# EAGLE design PiHat (EAGLE 9.3.2)

## Sheet 1 of 3
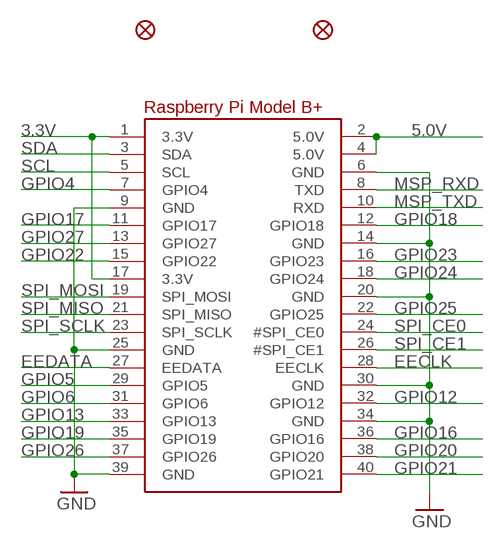
[diagram p0: schematic, sheet 1]

### Parts
FID2  FIDUCIAL""  [FIDUCIAL_1MM]
FID3  FIDUCIAL""  [FIDUCIAL_1MM]
RPI1  RASPBERRYPI_BPLUS_HATNOSLOTS  [PI_HAT_NOSLOTS]

### Nets
3.3V: RPI1.1(3.3V) RPI1.17(3.3V)
5.0V: RPI1.2(5.0V) RPI1.4(5.0V) ; also sheet 2,3
EECLK: RPI1.28(EECLK)
EEDATA: RPI1.27(EEDATA)
GND: RPI1.6(GND) RPI1.9(GND) RPI1.14(GND) RPI1.20(GND) RPI1.25(GND) RPI1.30(GND) RPI1.34(GND) RPI1.39(GND) ; also sheet 2,3
GPIO4: RPI1.7(GPIO4)
GPIO5: RPI1.29(GPIO5) ; also sheet 2
GPIO6: RPI1.31(GPIO6) ; also sheet 2
GPIO12: RPI1.32(GPIO12)
GPIO13: RPI1.33(GPIO13)
GPIO16: RPI1.36(GPIO16) ; also sheet 2
GPIO17: RPI1.11(GPIO17) ; also sheet 2
GPIO18: RPI1.12(GPIO18) ; also sheet 2
GPIO19: RPI1.35(GPIO19) ; also sheet 2
GPIO20: RPI1.38(GPIO20)
GPIO21: RPI1.40(GPIO21)
GPIO22: RPI1.15(GPIO22)
GPIO23: RPI1.16(GPIO23)
GPIO24: RPI1.18(GPIO24) ; also sheet 2
GPIO25: RPI1.22(GPIO25) ; also sheet 2
GPIO26: RPI1.37(GPIO26) ; also sheet 2
GPIO27: RPI1.13(GPIO27) ; also sheet 2
MSP_RXD: RPI1.8(TXD) ; also sheet 2,3
MSP_TXD: RPI1.10(RXD) ; also sheet 2,3
SCL: RPI1.5(SCL)
SDA: RPI1.3(SDA)
SPI_CE0: RPI1.24(#SPI_CE0)
SPI_CE1: RPI1.26(#SPI_CE1)
SPI_MISO: RPI1.21(SPI_MISO)
SPI_MOSI: RPI1.19(SPI_MOSI)
SPI_SCLK: RPI1.23(SPI_SCLK)

## Sheet 2 of 3
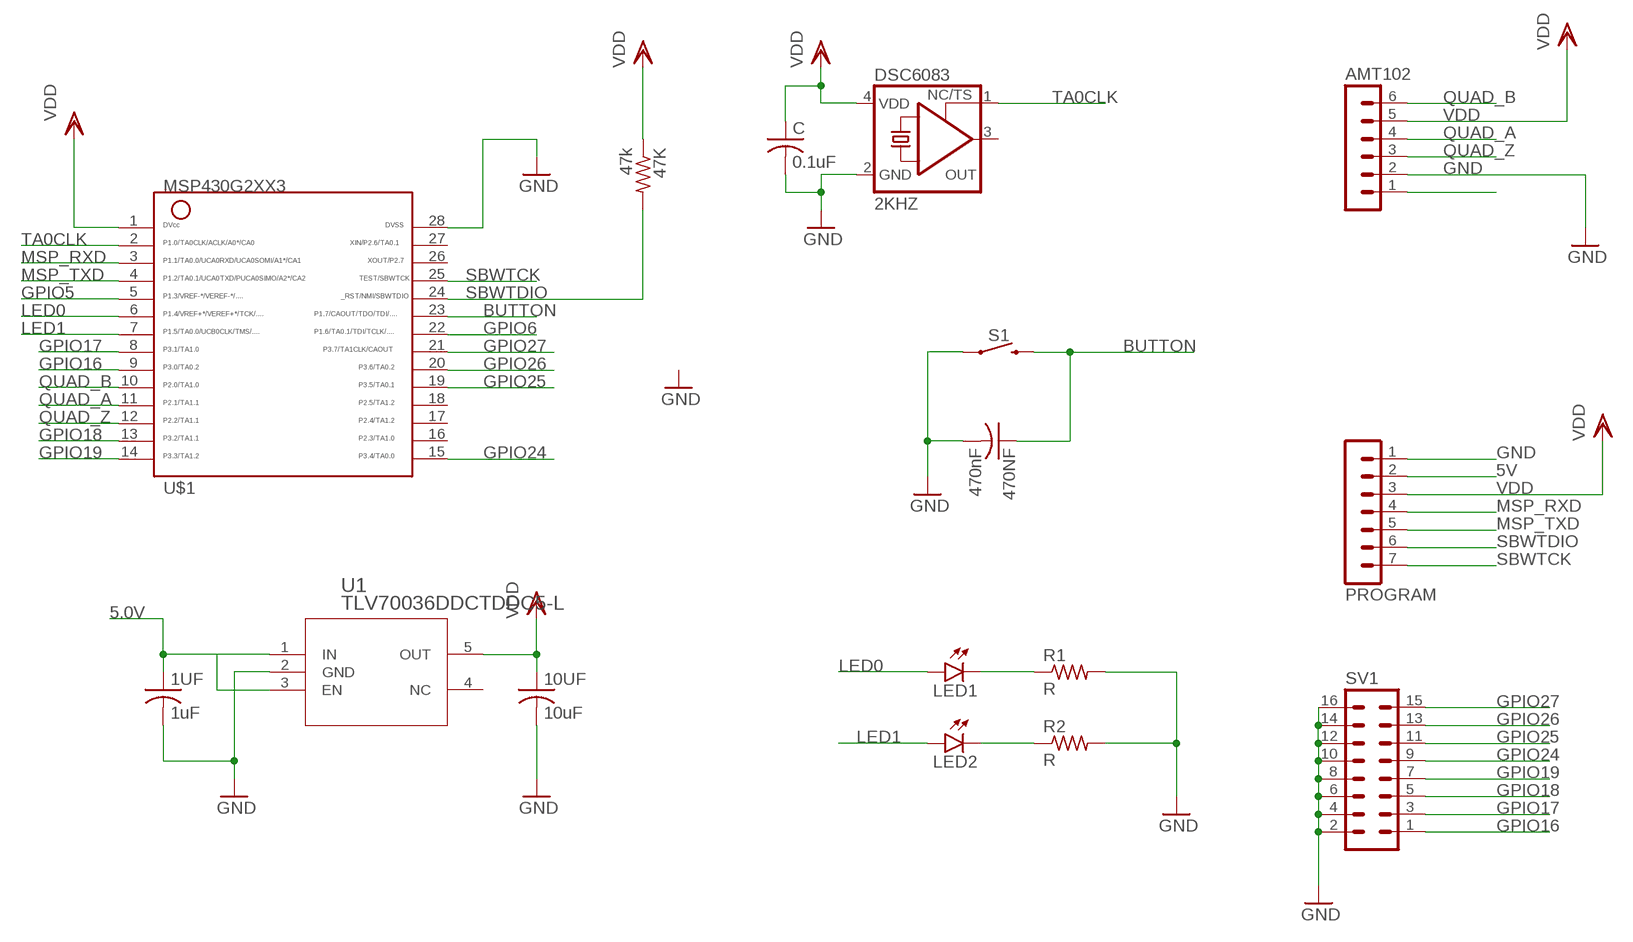
[diagram p1: schematic, sheet 2]

### Parts
1UF  1uF  C-USC0603  [C0603]
10UF  10uF  C-USC1206  [C1206]
47K  47k  R-US_R0603  [R0603]
470NF  470nF  C-USC0603  [C0603]
AMT102  MA06-1  [MA06-1]
C  0.1uF  C-USC0603  [C0603]
DSC6083  2KHZ  KXO-PXO/XO-V96  [3.2X2.5_KXO-V96]
LED1  LEDCHIPLED_1206  [CHIPLED_1206]
LED2  LEDCHIPLED_1206  [CHIPLED_1206]
PROGRAM  MA07-1  [MA07-1]
R1  R  R-US_R0603  [R0603]
R2  R  R-US_R0603  [R0603]
S1  MOMENTARY-SWITCH-SPST-PTH-6.0MM  [TACTILE_SWITCH_PTH_6.0MM]
SV1  MA08-2  [MA08-2]
U1  TLV70036DDCTDDC5-L  [DDC5-L]
U$1  MSP430  G2XX3---PW28  [PW28]

### Nets
5.0V: 1UF.1 U1.1(IN) U1.3(EN) ; also sheet 1,3
5V: PROGRAM.2
BUTTON: 470NF.1 S1.3 U$1.23
GND: 1UF.2 10UF.2 470NF.2 AMT102.2 C.2 DSC6083.2(GND) PROGRAM.1 R1.2 R2.2 S1.1 SV1.2 SV1.4 SV1.6 SV1.8 SV1.10 SV1.12 SV1.14 SV1.16 U1.2(GND) U$1.28 ; also sheet 1,3
GPIO5: U$1.5 ; also sheet 1
GPIO6: U$1.22 ; also sheet 1
GPIO16: SV1.1 U$1.9 ; also sheet 1
GPIO17: SV1.3 U$1.8 ; also sheet 1
GPIO18: SV1.5 U$1.13 ; also sheet 1
GPIO19: SV1.7 U$1.14 ; also sheet 1
GPIO24: SV1.9 U$1.15 ; also sheet 1
GPIO25: SV1.11 U$1.19 ; also sheet 1
GPIO26: SV1.13 U$1.20 ; also sheet 1
GPIO27: SV1.15 U$1.21 ; also sheet 1
LED0: LED1.A U$1.6
LED1: LED2.A U$1.7
MSP_RXD: PROGRAM.4 U$1.3 ; also sheet 1,3
MSP_TXD: PROGRAM.5 U$1.4 ; also sheet 1,3
N$1: LED1.C R1.1
N$2: LED2.C R2.1
N$6: AMT102.1
QUAD_A: AMT102.4 U$1.11
QUAD_B: AMT102.6 U$1.10
QUAD_Z: AMT102.3 U$1.12
SBWTCK: PROGRAM.7 U$1.25
SBWTDIO: 47K.2 PROGRAM.6 U$1.24
TA0CLK: DSC6083.1(TS) U$1.2
VDD: 10UF.1 47K.1 AMT102.5 C.1 DSC6083.4(VDD) PROGRAM.3 U1.5(OUT) U$1.1
Unconnected: DSC6083.3(OUT) U1.4(NC) U$1.16 U$1.17 U$1.18 U$1.26 U$1.27

## Sheet 3 of 3
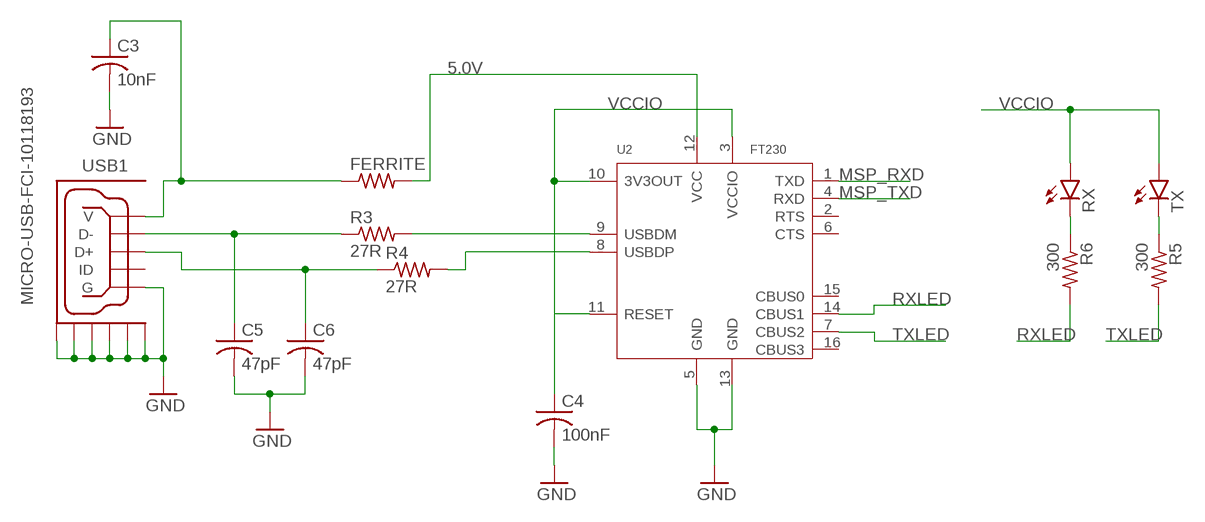
[diagram p2: schematic, sheet 3]

### Parts
C3  10nF  C-USC0603  [C0603]
C4  100nF  C-USC0603  [C0603]
C5  47pF  C-USC0603  [C0603]
C6  47pF  C-USC0603  [C0603]
FERRITE  R-US_R0805  [R0805]
R3  27R  R-US_R0603  [R0603]
R4  27R  R-US_R0603  [R0603]
R5  300  R-US_R0603  [R0603]
R6  300  R-US_R0603  [R0603]
RX  LEDCHIPLED_1206  [CHIPLED_1206]
TX  LEDCHIPLED_1206  [CHIPLED_1206]
U2  FT230  INTERFACE-FT230XS-R(SSOP16)  [SSOP16-0.635-5X4MM]
USB1  MICRO-USB-FCI-10118193  [FCI-10118193-0001LF]

### Nets
5.0V: FERRITE.2 U2.12(VCC) ; also sheet 1,2
GND: C3.2 C4.2 C5.2 C6.2 U2.5(GND) U2.13(GND) USB1.5(G) USB1.G1(GND1) USB1.G2(GND2) USB1.G3(GND3) USB1.G4(GND4) USB1.G5(GND5) USB1.G6(GND6) ; also sheet 1,2
MSP_RXD: U2.1(TXD) ; also sheet 1,2
MSP_TXD: U2.4(RXD) ; also sheet 1,2
N$3: C3.1 FERRITE.1 USB1.1(V)
N$4: C5.1 R3.1 USB1.2(D-)
N$5: R3.2 U2.9(USBDM)
N$7: C6.1 R4.1 USB1.3(D+)
N$8: R4.2 U2.8(USBDP)
N$9: R6.1 RX.C
N$10: R5.1 TX.C
RXLED: R6.2 U2.14(CBUS1)
TXLED: R5.2 U2.7(CBUS2)
VCCIO: C4.1 RX.A TX.A U2.3(VCCIO) U2.10(3V3OUT) U2.11(RESET)
Unconnected: U2.2(RTS) U2.6(CTS) U2.15(CBUS0) U2.16(CBUS3) USB1.4(ID)

## Library data of the parts
1UF 10UF 470NF C = rcl:C-US: CAPACITOR, American symbol; SPICEPREFIX: C
47K FERRITE R1 R2 = rcl:R-US_: RESISTOR, American symbol; SPICEPREFIX: R
AMT102 = con-lstb-mod:MA06-1: PIN HEADER; OC_FARNELL: unknown; OC_NEWARK: unknown
C3-C6 = resistor:C-US: CAPACITOR, American symbol
DSC6083 = crystal-geyer_V1_0:KXO-PXO/XO-V: Clock Oscillator (PXO/XO) MHz : KXO-V - Serie Model Size l/w/h [mm] Frequency Range Frequency Stability Temp. Range [°C] Output AECQ 200 availabel Datasheet KXO-V94 KXO-V94 KXO-V95 KXO-V95 KXO-V96 KXO-V96 KXO-V99 KXO-V99 KXO-97 KXO-V97 KXO-97 - KXO-V97 2.0/1.6/0.80 2.0/1.6/0.80 2.5/2.0/0.82 2.5/2.0/0.82 3.2/2.5/1.2 3.2/2.5/1.2 5.0/3.2/1.2 5.0/3.2/1.2 7.0/5.08/1.3 7.0/5.08/1.3 7.0/5.08/1.3 32,768 kHz 1,0 ~ 80,0 MHz 32,768 kHz 1,0 ~ 70,0 MHz 32,768 kHz 1,0 ~ 156,0 MHz 32,768 kHz 1,0 ~ 200,0 MHz 32,768 kHz 32,768 kHz 1,0 ~ 160,0 MHz ±25 … ±100ppm ±25 … ±100ppm ±25 … ±100ppm ±25 … ±100ppm ±25 … ±100ppm ±25 … ±100ppm ±25 … ±100ppm ±25 … ±100ppm ±25 … ±100ppm ±25 … ±100ppm ±25 … ±100ppm (*) -40°C …+85°C (*) -40°C …+85°C (*) -40°C …+85°C (*) -40°C …+85°C (*) -40°C …+85°C (*) -40°C …+85°C (*) -40°C …+85°C (*) -40°C …+85°C (*) -40°C …+85°C (*) -40°C …+85°C (*) -40°C …+85°C HCMOS HCMOS HCMOS HCMOS HCMOS HCMOS HCMOS HCMOS HCMOS HCMOS HCMOS - - yes yes yes yes - - - - - KXO-V94-kHz.pdf <http://www.geyer-electronic.de/uploads/tx_userartikelfrequenz/GEYER-KXO-V94-kHz.pdf> KXO-V94.pdf <http://www.geyer-electronic.de/uploads/tx_userartikelfrequenz/GEYER-KXO-V94.pdf> KXO-V95-kHz.pdf <http://www.geyer-electronic.de/uploads/tx_userartikelfrequenz/GEYER-KXO-V95-kHz.pdf> KXO-V95.pdf <http://www.geyer-electronic.de/uploads/tx_userartikelfrequenz/GEYER-KXO-V95.pdf> KXO-V96-kHz.pdf <http://www.geyer-electronic.de/uploads/tx_userartikelfrequenz/GEYER-KXO-V96-kHz.pdf> KXO-V96.pdf <http://www.geyer-electronic.de/uploads/tx_userartikelfrequenz/GEYER-KXO-V96.pdf> KXO-V99-kHz.pdf <http://www.geyer-electronic.de/uploads/tx_userartikelfrequenz/GEYER-KXO-V99-kHz.pdf> KXO-V99.pdf <http://www.geyer-electronic.de/uploads/tx_userartikelfrequenz/GEYER-KXO-V99.pdf> KXO-97-kHz.pdf <http://www.geyer-electronic.de/uploads/tx_userartikelfrequenz/GEYER-KXO-97-kHz.pdf> KXO-V97-kHz.pdf <http://www.geyer-electronic.de/uploads/tx_userartikelfrequenz/GEYER-KXO-V97-kHz.pdf> KXO-V97.pdf <http://www.geyer-electronic.de/uploads/tx_userartikelfrequenz/GEYER-KXO-V97.pdf> <http://www.geyer-electronic.de/fileadmin/template/img/logo-geyer-electronic.png> Details see: http://www.geyer-electronic.de/Frequenz-Produkte.9.0.html Created 2016-06-07, Hans Locher 2016 (C) Geyer Quartz Technology Hans Locher KXOV94,KXOV95;KXOV96;KXOV97;KXO97;2016;2520;3225;5032;70508;2,5x2,0;3,2x2,5;5,0x3,2;7,0x5,08;2.5x2.0;3.2x2.5;5.0x3.2;7.0x5.08;
FID2 FID3 = microbuilder:FIDUCIAL: Fiducial Alignment Points Various fiducial points for machine vision alignment.; BOM: EXCLUDE
LED1 LED2 RX TX = led:LED: LED OSRAM: - CHIPLED LG R971, LG N971, LY N971, LG Q971, LY Q971, LO R971, LY R971 LH N974, LH R974 LS Q976, LO Q976, LY Q976 LO Q996 - Hyper CHIPLED LW Q18S LB Q993, LB Q99A, LB R99A - SideLED LS A670, LO A670, LY A670, LG A670, LP A670 LB A673, LV A673, LT A673, LW A673 LH A674 LY A675 LS A676, LA A676, LO A676, LY A676, LW A676 LS A679, LY A679, LG A679 - Hyper Micro SIDELED® LS Y876, LA Y876, LO Y876, LY Y876 LT Y87S - SmartLED LW L88C, LW L88S LB L89C, LB L89S, LG L890 LS L89K, LO L89K, LY L89K LS L896, LA L896, LO L896, LY L896 - TOPLED LS T670, LO T670, LY T670, LG T670, LP T670 LSG T670, LSP T670, LSY T670, LOP T670, LYG T670 LG T671, LOG T671, LSG T671 LB T673, LV T673, LT T673, LW T673 LH T674 LS T676, LA T676, LO T676, LY T676, LB T676, LH T676, LSB T676, LW T676 LB T67C, LV T67C, LT T67C, LS T67K, LO T67K, LY T67K, LW E67C LS E67B, LA E67B, LO E67B, LY E67B, LB E67C, LV E67C, LT E67C LW T67C LS T679, LY T679, LG T679 LS T770, LO T770, LY T770, LG T770, LP T770 LB T773, LV T773, LT T773, LW T773 LH T774 LS E675, LA E675, LY E675, LS T675 LS T776, LA T776, LO T776, LY T776, LB T776 LHGB T686 LT T68C, LB T68C - Hyper Mini TOPLED® LB M676 - Mini TOPLED Santana® LG M470 LS M47K, LO M47K, LY M47K Source: http://www.osram.convergy.de LUXEON: - LUMILED® LXK2-PW12-R00, LXK2-PW12-S00, LXK2-PW14-U00, LXK2-PW14-V00 LXK2-PM12-R00, LXK2-PM12-S00, LXK2-PM14-U00 LXK2-PE12-Q00, LXK2-PE12-R00, LXK2-PE12-S00, LXK2-PE14-T00, LXK2-PE14-U00 LXK2-PB12-K00, LXK2-PB12-L00, LXK2-PB12-M00, LXK2-PB14-N00, LXK2-PB14-P00, LXK2-PB14-Q00 LXK2-PR12-L00, LXK2-PR12-M00, LXK2-PR14-Q00, LXK2-PR14-R00 LXK2-PD12-Q00, LXK2-PD12-R00, LXK2-PD12-S00 LXK2-PH12-R00, LXK2-PH12-S00 LXK2-PL12-P00, LXK2-PL12-Q00, LXK2-PL12-R00 Source: www.luxeon.com KINGBRIGHT: KA-3528ASYC Source: www.kingbright.com
PROGRAM = con-lstb-mod:MA07-1: PIN HEADER; OC_FARNELL: unknown; OC_NEWARK: unknown
R3-R6 = resistor:R-US_: RESISTOR, American symbol
RPI1 = microbuilder:RASPBERRYPI_BPLUS
S1 = SparkFun-Switches:MOMENTARY-SWITCH-SPST: Momentary Switch (Pushbutton) - SPST Normally-open (NO) SPST momentary switches (buttons, pushbuttons). Variants PTH-12MM - 12mm square, through-hole Momentary Pushbutton Switch - 12mm Square <https://www.sparkfun.com/products/9190> (COM-09190) PTH-6.0MM, PTH-6.0MM-KIT - 6.0mm square, through-hole Mini Pushbutton Switch <https://www.sparkfun.com/products/97> (COM-00097) KIT package intended for soldering kit's - only one side of pads' copper is exposed. PTH-RIGHT-ANGLE-KIT - Right-angle, through-hole Right Angle Tactile Button <https://www.sparkfun.com/products/10791> - Used on SparkFun BigTime Watch Kit <https://www.sparkfun.com/products/11734> SMD-12MM - 12mm square, surface-mount Tactile Button - SMD (12mm) <https://www.sparkfun.com/products/12993> (COM-12993) Used on SparkFun PicoBoard <https://www.sparkfun.com/products/11888> SMD-4.5MM - 4.5mm Square Trackball Switch Used on SparkFun Blackberry Trackballer Breakout <https://www.sparkfun.com/products/13169> SMD-4.6MMX2.8MM - 4.60mm x 2.80mm, surface mount Used on SparkFun SAMD21 Mini Breakout <https://www.sparkfun.com/products/13664> SMD-5.2MM, SMD-5.2-REDUNDANT - 5.2mm square, surface-mount Mini Pushbutton Switch - SMD <https://www.sparkfun.com/products/8720> (COM-08720) Used on Arduino Pro Mini <https://www.sparkfun.com/products/11114> REDUNDANT package connects both switch circuits together SMD-6.0X3.5MM - 6.0 x 3.5mm, surface mount Momentary Reset Switch SMD <https://www.sparkfun.com/products/8229> (COM-08229) SMD-6.2MM-TALL - 6.2mm square, surface mount Tactile Button - SMD (6mm) <https://www.sparkfun.com/products/12992> Used on SparkFun Digital Sandbox <https://www.sparkfun.com/products/12651> SMD-RIGHT-ANGLE - Right-angle, surface mount Used on SparkFun Block for Intel® Edison - Arduino <https://www.sparkfun.com/products/13036>; PROD_ID: SWCH-08441; SF_SKU: COM-00097
SV1 = con-lstb-mod:MA08-2: PIN HEADER; OC_FARNELL: unknown; OC_NEWARK: unknown
U1 = TLV70036:TLV70036DDCT; MANUFACTURER_PART_NUMBER: TLV70036DDCT; VENDOR: Texas Instruments
U2 = OPL_IC:INTERFACE-FT230XS-R(SSOP16): 310070030; MPN: FT230XS-R; VALUE: FT230XS-R-SSOP16
U$1 = TI_MSP430_v16:G2XX3---PW28: MSP430G2XX1 TSSOP (PW) 28 Pin Package
USB1 = microftx:MICRO-USB: MICRO USB B, BOTTOM MOUNT From the MicroFTX by Jim Paris (http://jim.sh/ftx)

## Board
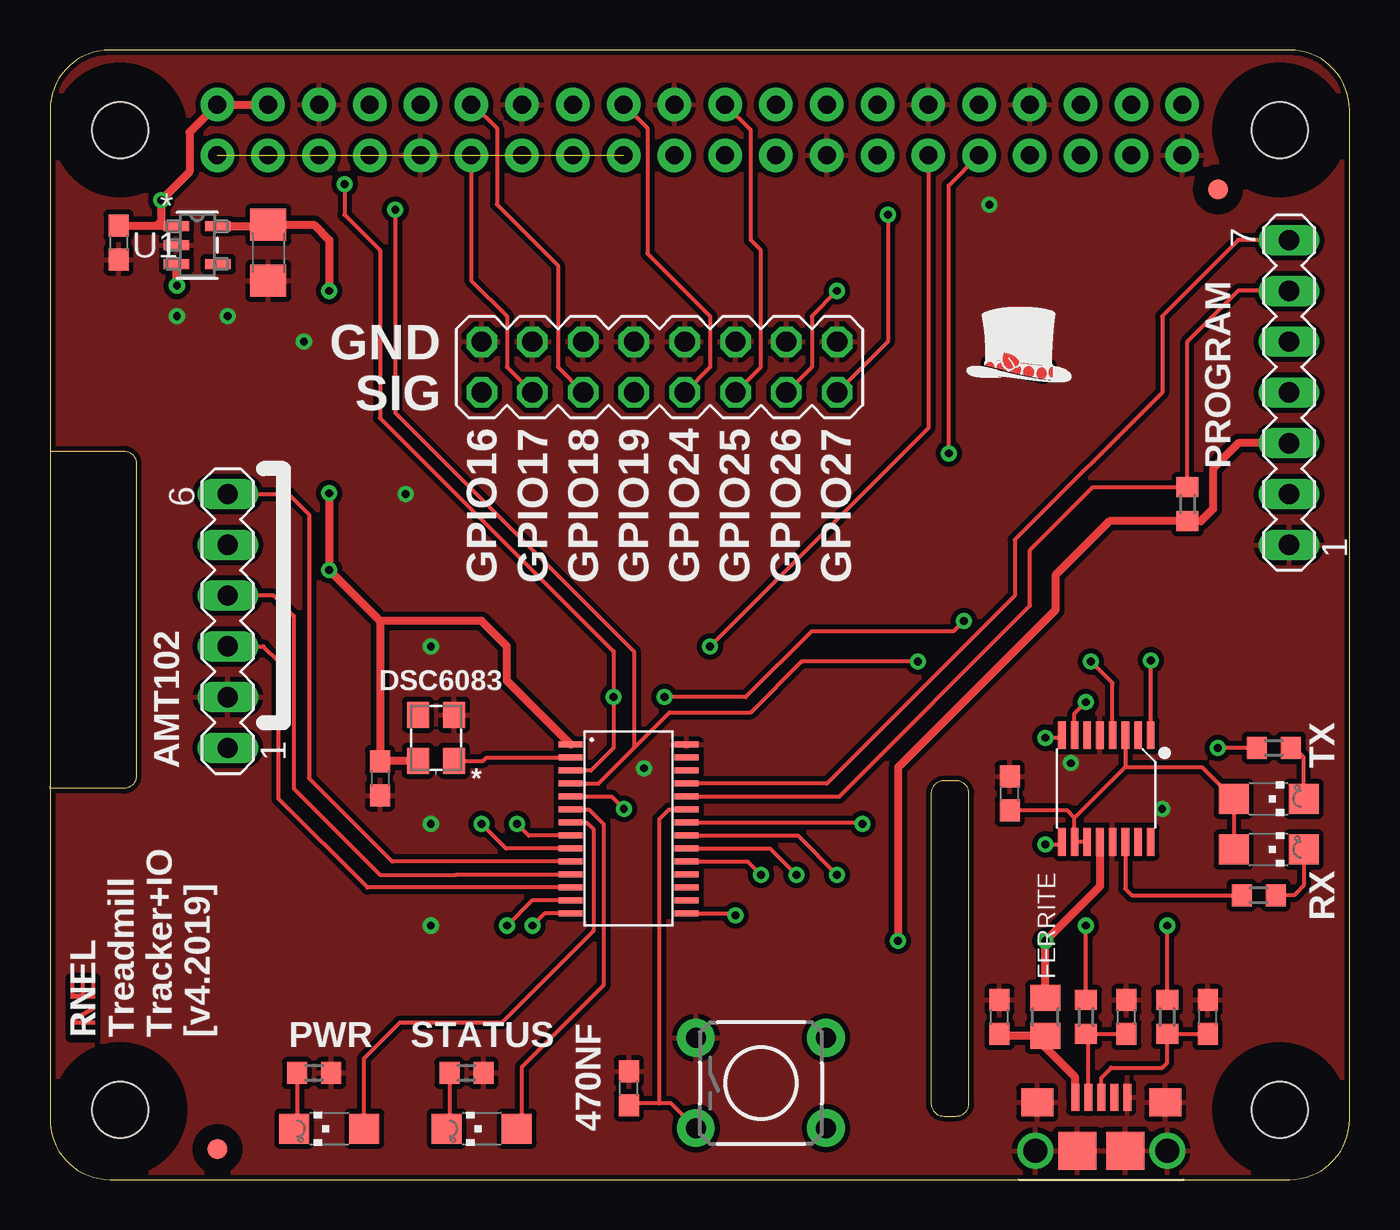
[diagram p3: board, top side]
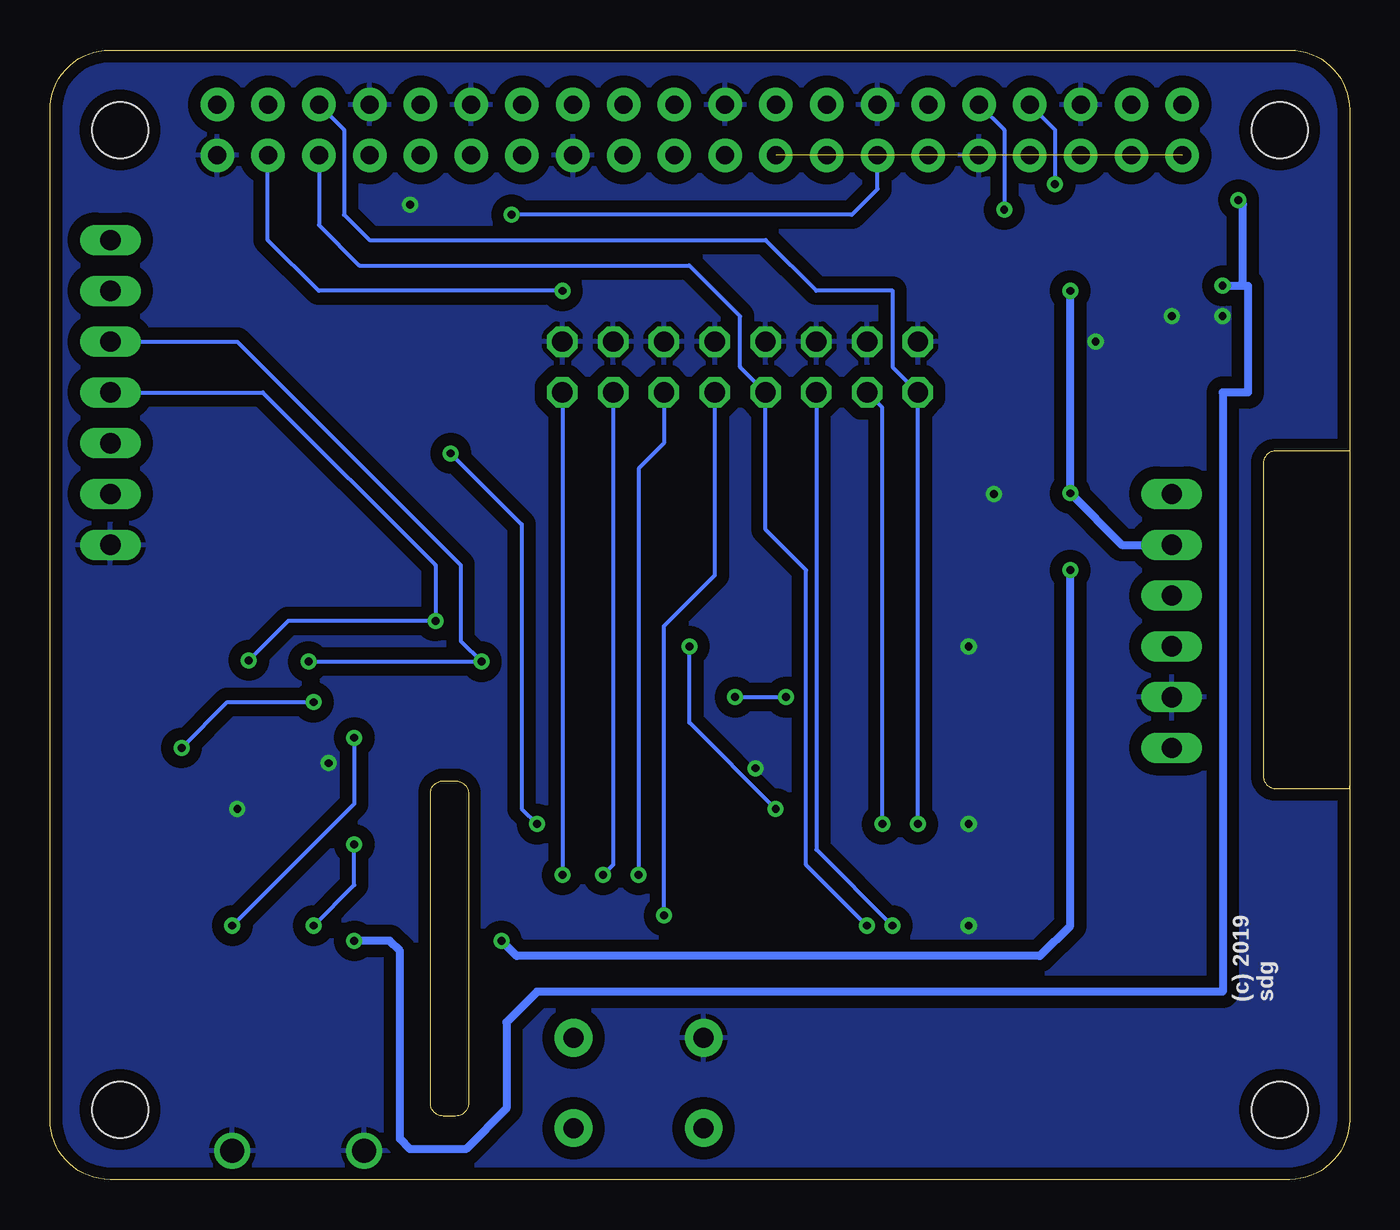
[diagram p4: board, bottom side, seen from below]

Size 65 x 56.5 mm. Coordinates in mm from the lower left corner, seen from the top.
Outline: 0,36.45 3.68,36.45 arc-90 4.32,35.81 4.32,20.19 arc-90 3.68,19.56 0,19.56 0,19.68
Outline: 44.7,3.17 45.34,3.17 arc90 45.97,3.81 45.97,19.3 arc90 45.34,19.94 44.7,19.94 arc90 44.07,19.3 44.07,3.81 arc90 44.7,3.17
Copper layers (1*16): Top 0.035mm / dielectric 1.5mm / Bottom 0.035mm
Design rules "adafruit *": minimum track width 8mil, minimum drill 15.5mil, track to track 8mil, track to pad 8mil, pad to pad 8mil, via to via 8mil, smd to smd 8mil, copper to edge 10mil, drill to drill 8mil, minimum pad ring 10mil, minimum via ring 8mil, stop-mask expansion 2mil, vias tented up to drill 20mil, thermal gap 10mil

### Footprints (pad centres in the part's own frame; a part is rotated, then mirrored left to right if it is on the bottom)
C0603 = smd 1.1 x 1: 1 -0.85,0; 2 0.85,0
C1206 = smd 1.6 x 1.8: 1 -1.4,0; 2 1.4,0
R0603 = smd 1 x 1.1: 1 -0.85,0; 2 0.85,0
MA06-1 = drill 1.016 long: 1 -6.35,0; 2 -3.81,0; 3 -1.27,0; 4 1.27,0; 5 3.81,0; 6 6.35,0
3.2X2.5_KXO-V96 = smd 1.3 x 1.1: 1 -1.15,-0.9; 2 1.15,-0.9; 3 1.15,0.9; 4 -1.15,0.9
R0805 = smd 1.3 x 1.5: 1 -0.95,0; 2 0.95,0
FIDUCIAL_1MM = smd 1 x 1: 1 0,0
CHIPLED_1206 = smd 1.5 x 1.5: A 0,-1.75; C 0,1.75
MA07-1 = drill 1.016 long: 1 -7.62,0; 2 -5.08,0; 3 -2.54,0; 4 0,0; 5 2.54,0; 6 5.08,0; 7 7.62,0
PI_HAT_NOSLOTS = drill 0.9 pad 1.676: 1 8.37,51.23; 2 8.37,53.77; 3 10.91,51.23; 4 10.91,53.77; 5 13.45,51.23; 6 13.45,53.77; 7 15.99,51.23; 8 15.99,53.77; 9 18.53,51.23; 10 18.53,53.77; 11 21.07,51.23; 12 21.07,53.77; 13 23.61,51.23; 14 23.61,53.77; 15 26.15,51.23; 16 26.15,53.77; 17 28.69,51.23; 18 28.69,53.77; 19 31.23,51.23; 20 31.23,53.77; 21 33.77,51.23; 22 33.77,53.77; 23 36.31,51.23; 24 36.31,53.77; 25 38.85,51.23; 26 38.85,53.77; 27 41.39,51.23; 28 41.39,53.77; 29 43.93,51.23; 30 43.93,53.77; 31 46.47,51.23; 32 46.47,53.77; 33 49.01,51.23; 34 49.01,53.77; 35 51.55,51.23; 36 51.55,53.77; 37 54.09,51.23; 38 54.09,53.77; 39 56.63,51.23; 40 56.63,53.77 | hole 2.8: 3.5,3.5; 3.5,52.5; 61.5,52.5; 61.5,3.5
TACTILE_SWITCH_PTH_6.0MM = drill 1.016 pad 1.88: 1 -3.251,2.261; 2 3.251,2.261; 3 -3.251,-2.261; 4 3.251,-2.261
MA08-2 = drill 1.016 octagon: 1 -8.89,-1.27; 2 -8.89,1.27; 3 -6.35,-1.27; 4 -6.35,1.27; 5 -3.81,-1.27; 6 -3.81,1.27; 7 -1.27,-1.27; 8 -1.27,1.27; 9 1.27,-1.27; 10 1.27,1.27; 11 3.81,-1.27; 12 3.81,1.27; 13 6.35,-1.27; 14 6.35,1.27; 15 8.89,-1.27; 16 8.89,1.27
DDC5-L = smd 1.27 x 0.508: 1 -1.041,0.95; 2 -1.041,0; 3 -1.041,-0.95; 4 1.041,-0.95; 5 1.041,0.95
SSOP16-0.635-5X4MM = smd 0.381 x 1.397: 1 -2.223,-2.667; 2 -1.587,-2.667; 3 -0.953,-2.667; 4 -0.318,-2.667; 5 0.318,-2.667; 6 0.953,-2.667; 7 1.587,-2.667; 8 2.223,-2.667; 9 2.223,2.667; 10 1.587,2.667; 11 0.953,2.667; 12 0.318,2.667; 13 -0.318,2.667; 14 -0.953,2.667; 15 -1.587,2.667; 16 -2.223,2.667
PW28 = smd 0.3 x 1.2: 1 -4.229,-2.908; 2 -3.579,-2.908; 3 -2.929,-2.908; 4 -2.279,-2.908; 5 -1.629,-2.908; 6 -0.979,-2.908; 7 -0.329,-2.908; 8 0.321,-2.908; 9 0.971,-2.908; 10 1.621,-2.908; 11 2.271,-2.908; 12 2.921,-2.908; 13 3.571,-2.908; 14 4.221,-2.908; 15 4.221,2.892; 16 3.571,2.892; 17 2.921,2.892; 18 2.271,2.892; 19 1.621,2.892; 20 0.971,2.892; 21 0.321,2.892; 22 -0.329,2.892; 23 -0.979,2.892; 24 -1.629,2.892; 25 -2.279,2.892; 26 -2.929,2.892; 27 -3.579,2.892; 28 -4.229,2.892
FCI-10118193-0001LF = smd 0.4 x 1.35: 1 -1.3,4.125; 2 -0.65,4.125; 3 0,4.125; 4 0.65,4.125; 5 1.3,4.125 | smd 1.6 x 1.4: G1 -3.2,3.86; G2 3.2,3.86 | smd 1.9 x 1.9: G3 -1.2,1.45; G4 1.2,1.45 | drill 1.2 pad 1.6: G5 -3.3,1.45; G6 3.3,1.45

### Placement (x,y rotation side)
1UF  3.43,46.86 270 top
10UF  10.92,46.35 270 top
47K  56.9,33.78 90 top
470NF  28.96,4.57 90 top
AMT102  8.89,27.94 90 top
C  16.51,20.07 270 top
C3  47.5,8.13 90 top
C4  48.01,19.3 90 top
C5  53.85,8.13 90 top
C6  57.91,8.13 90 top
DSC6083  19.3,22.1 90 top
FERRITE  49.78,8.13 90 top
FID2  8.38,1.52 0 top
FID3  58.42,49.53 0 top
LED1  21.59,2.54 90 top
LED2  13.97,2.54 90 top
PROGRAM  61.98,39.37 90 top
R1  20.83,5.33 0 top
R2  13.21,5.33 0 top
R3  51.82,8.13 90 top
R4  55.88,8.13 90 top
R5  61.21,21.59 180 top
R6  60.45,14.22 180 top
RPI1  0,0 0 top
RX  60.96,16.51 270 top
S1  35.56,4.83 0 top
SV1  30.48,40.64 0 top
TX  60.96,19.05 270 top
U1  7.37,46.74 0 top
U2  52.83,19.56 180 top
U$1  28.96,17.53 270 top
U$2  [PIHATLOGO]  45.85,39.88 0 top
USB1  52.58,0 0 top

### Tracks (layer width: path | path; a pad name or v marks a point on that pad's centre or on a via)
3.3V  (1 unrouted)
5.0V  (via drill 0.39)
  Top 0.406: RPI1.4 RPI1.2 6.99,52.38 6.99,50.42 v5.56,48.99 5.56,47.94 5.33,47.71 | 1UF.1 5.33,47.71 | 5.33,47.71 6.3,47.71 U1.1 | U1.3 6.33,44.73 v6.35,44.7 | U2.12 52.51,14.67 v49.78,11.94 FERRITE.2
  Bottom 0.406: 5.33,44.7 5.33,48.77 v5.56,48.99 | v6.35,44.7 5.33,44.7 | 5.33,44.7 5.08,44.7 5.08,39.37 6.35,39.37 6.35,9.4 40.64,9.4 42.16,7.87 42.16,3.56 44.2,1.52 46.99,1.52 47.5,2.03 47.5,11.43 48.01,11.94 v49.78,11.94
BUTTON
  Top 0.203: S1.3 31.06,3.81 30.48,3.81 | 470NF.1 29.04,3.81 30.48,3.81 | U$1.23 30.95,18.5 30.48,18.03 30.48,3.81
GND  (via drill 0.39)
  other vias: 12.7,41.91 46.99,48.77 17.78,34.29 6.35,43.18 8.89,43.18 19.05,26.67 29.72,20.57 19.05,17.78 19.05,12.7 51.05,20.83 55.63,18.54
  pour Top (isolate 0.254): 0,0 0,56.39 65.02,56.39 65.02,0
  pour Bottom (isolate 0.61): 0,56.39 65.02,56.39 65.02,0 0,0
GPIO5  (via drill 0.39)
  Top 0.203: U$1.5 28.09,19.16 v28.7,18.54 | RPI1.29 43.93,37.58 v33.02,26.67
  Bottom 0.203: v28.7,18.54 33.02,22.86 v33.02,26.67
GPIO6  (via drill 0.39)
  Top 0.203: RPI1.31 44.96,49.72 v44.96,36.32 | U$1.22 40.56,17.86 v40.64,17.78
  Bottom 0.203: v40.64,17.78 41.4,18.54 41.4,32.77 v44.96,36.32
GPIO16  (via drill 0.39)
  Top 0.203: U$1.9 22.82,16.55 v21.59,17.78
  Bottom 0.203: RPI1.36 50.29,52.51 50.29,48.26 49.02,46.99 29.21,46.99 26.67,44.45 22.86,44.45 22.86,40.64 SV1.1 v21.59,17.78
GPIO17  (via drill 0.39)
  Top 0.203: SV1.3 22.86,40.64 22.86,43.18 21.07,44.97 RPI1.11 | U$1.8 23.94,17.2 v23.37,17.78
  Bottom 0.203: v23.37,17.78 23.37,38.61 SV1.3
GPIO18  (via drill 0.39)
  Top 0.203: RPI1.12 21.16,53.77 22.35,52.58 22.35,48.77 25.4,45.72 25.4,40.64 SV1.5 | U$1.13 24.11,13.96 v22.86,12.7
  Bottom 0.203: SV1.5 26.67,16.51 v22.86,12.7
GPIO19  (via drill 0.39)
  Top 0.203: U$1.14 24.73,13.3 v24.13,12.7
  Bottom 0.203: RPI1.35 51.55,47.74 49.53,45.72 33.02,45.72 30.48,43.18 30.48,40.64 SV1.7 29.21,32.51 27.18,30.48 27.18,15.75 v24.13,12.7
GPIO24  (via drill 0.39)
  Top 0.203: RPI1.18 29.88,52.58 29.88,46.32 33.02,43.18 33.02,40.64 SV1.9 | U$1.15 34.19,13.3 v34.29,13.21
  Bottom 0.203: SV1.9 31.75,30.23 34.29,27.69 v34.29,13.21
GPIO25  (via drill 0.39)
  Top 0.203: RPI1.22 35.05,52.49 35.05,46.99 35.56,46.48 35.56,40.64 SV1.11 | U$1.19 34.9,15.9 v35.56,15.24
  Bottom 0.203: SV1.11 34.29,36.83 35.56,35.56 v35.56,15.24
GPIO26  (via drill 0.39)
  Top 0.203: v39.37,44.45 38.1,43.18 38.1,40.64 SV1.13 | U$1.20 36.02,16.55 v37.34,15.24
  Bottom 0.203: v39.37,44.45 51.56,44.45 54.1,46.99 54.1,51.22 RPI1.37 | SV1.13 36.83,15.75 v37.34,15.24
GPIO27  (via drill 0.39)
  Top 0.203: v41.91,48.26 41.91,41.91 SV1.15 | U$1.21 37.41,17.2 v39.37,15.24
  Bottom 0.203: v41.91,48.26 24.89,48.26 23.61,49.54 RPI1.13 | SV1.15 v39.37,15.24
LED0
  Top 0.203: LED1.A 23.59,2.79 23.59,5.62 27.69,9.71 27.69,17.78 26.96,18.5 U$1.6
LED1
  Top 0.203: LED2.A 15.72,6.07 17.5,7.85 22.58,7.85 27.18,12.45 27.18,17.53 26.85,17.86 U$1.7
MSP_RXD  (via drill 0.39)
  Top 0.203: U$1.3 27.06,20.45 28.19,21.59 v28.19,24.13 28.19,26.42 16.51,38.1 16.51,46.48 14.73,48.26 v14.73,49.78 | v30.73,24.13 34.8,24.13 38.1,27.43 45.21,27.43 v45.72,27.94 | U2.1 v55.05,25.97
  Bottom 0.203: RPI1.8 14.73,52.51 v14.73,49.78 | PROGRAM.4 54.36,39.37 45.72,30.73 v45.72,27.94 53.09,27.94 v55.05,25.97 | v30.73,24.13 v28.19,24.13
MSP_TXD  (via drill 0.39)
  Top 0.203: U$1.4 27.43,19.8 29.21,21.59 | 29.21,21.59 30.99,23.37 35.05,23.37 37.59,25.91 v43.41,25.91 | v17.27,48.51 17.27,38.35 29.21,26.42 29.21,21.59 | U2.4 53.15,24.83 v52.07,25.91
  Bottom 0.203: RPI1.10 17.27,52.51 v17.27,48.51 | PROGRAM.5 55.63,41.91 44.45,30.73 44.45,26.94 v43.41,25.91 v52.07,25.91
N$1
  Top 0.203: R1.1 19.98,2.68 LED1.C
N$2
  Top 0.203: R2.1 12.36,2.68 LED2.C
N$3
  Top 0.406: USB1.1 51.28,5.11 49.78,6.6 FERRITE.1 47.6,7.18 C3.1
N$4
  Top 0.203: USB1.2 51.93,7.17 R3.1 C5.1
N$5  (via drill 0.39)
  Top 0.203: v49.78,16.76 50.48,16.76 U2.9 | R3.2 v51.82,12.7
  Bottom 0.203: v51.82,12.7 49.78,14.73 v49.78,16.76
N$7
  Top 0.203: USB1.3 52.58,5.08 53.09,5.59 55.63,5.59 55.88,5.84 R4.1 C6.1
N$8  (via drill 0.39)
  Top 0.203: U2.8 50.48,22.1 v49.78,22.1 | R4.2 v55.88,12.7
  Bottom 0.203: v49.78,22.1 49.78,18.8 v55.88,12.7
N$9
  Top 0.203: RX.C 62.71,14.7 62.23,14.22 R6.1
N$10
  Top 0.203: R5.1 62.23,21.59 62.71,21.11 TX.C
QUAD_A
  Top 0.203: U$1.11 20.32,15.26 20.32,15.24 16.51,15.24 12.19,19.56 12.19,28.19 11.18,29.21 AMT102.4
QUAD_B
  Top 0.203: U$1.10 17.11,15.9 12.95,20.07 12.95,33.27 11.94,34.29 AMT102.6
QUAD_Z
  Top 0.203: U$1.12 15.88,14.61 11.43,19.05 11.43,25.91 10.67,26.67 AMT102.3
RXLED
  Top 0.203: U2.14 53.78,14.54 54.1,14.22 R6.2
SBWTCK
  Top 0.203: PROGRAM.7 59.44,46.99 55.63,43.18 55.63,39.37 48.26,32 48.26,29.21 38.85,19.8 U$1.25
SBWTDIO
  Top 0.203: PROGRAM.6 59.44,44.45 56.9,41.91 47K.2 52.16,34.63 49.02,31.5 49.02,28.7 39.48,19.16 U$1.24
TA0CLK
  Top 0.203: U$1.2 21.82,21.11 21.67,20.95 DSC6083.1
TXLED  (via drill 0.39)
  Top 0.203: U2.7 51.24,23.3 v51.82,23.88 | R5.2 v58.42,21.59
  Bottom 0.203: v58.42,21.59 56.13,23.88 v51.82,23.88
VCCIO
  Top 0.203: U2.11 U2.10 51.24,18.1 | C4.1 50.89,18.45 51.24,18.1 | U2.3 53.78,20.64 | 53.78,20.64 51.24,18.1 | 53.78,20.64 57.62,20.64 TX.A RX.A
VDD  (via drill 0.39)
  Top 0.406: v13.97,44.45 13.97,46.99 13.21,47.76 10UF.1 10.85,47.69 U1.5 | 16.51,27.94 v13.97,30.48 v13.97,34.33 | 16.51,27.94 C.1 16.54,20.95 DSC6083.4 | U$1.1 22.86,24.94 22.86,26.67 21.59,27.94 16.51,27.94 | v42.42,11.94 42.42,20.62 50.29,28.49 50.29,30.23 53,32.93 47K.1 57.57,32.93 58.17,33.53 58.17,35.56 59.44,36.83 PROGRAM.3
  Bottom 0.406: v13.97,44.45 v13.97,34.33 11.39,31.75 AMT102.5 | v13.97,30.48 13.97,12.7 15.49,11.18 41.66,11.18 v42.42,11.94

### Text on the board
Top: NE
tPlace: GND | SIG | GPIO16 / GPIO17 / GPIO18 / GPIO19 / GPIO24 / GPIO25 / GPIO26 / GPIO27 | * | RNEL / Treadmill / Tracker+IO / [v4.2019] | PWR | STATUS
bPlace: (c) 2019 / sdg
tStop: NE